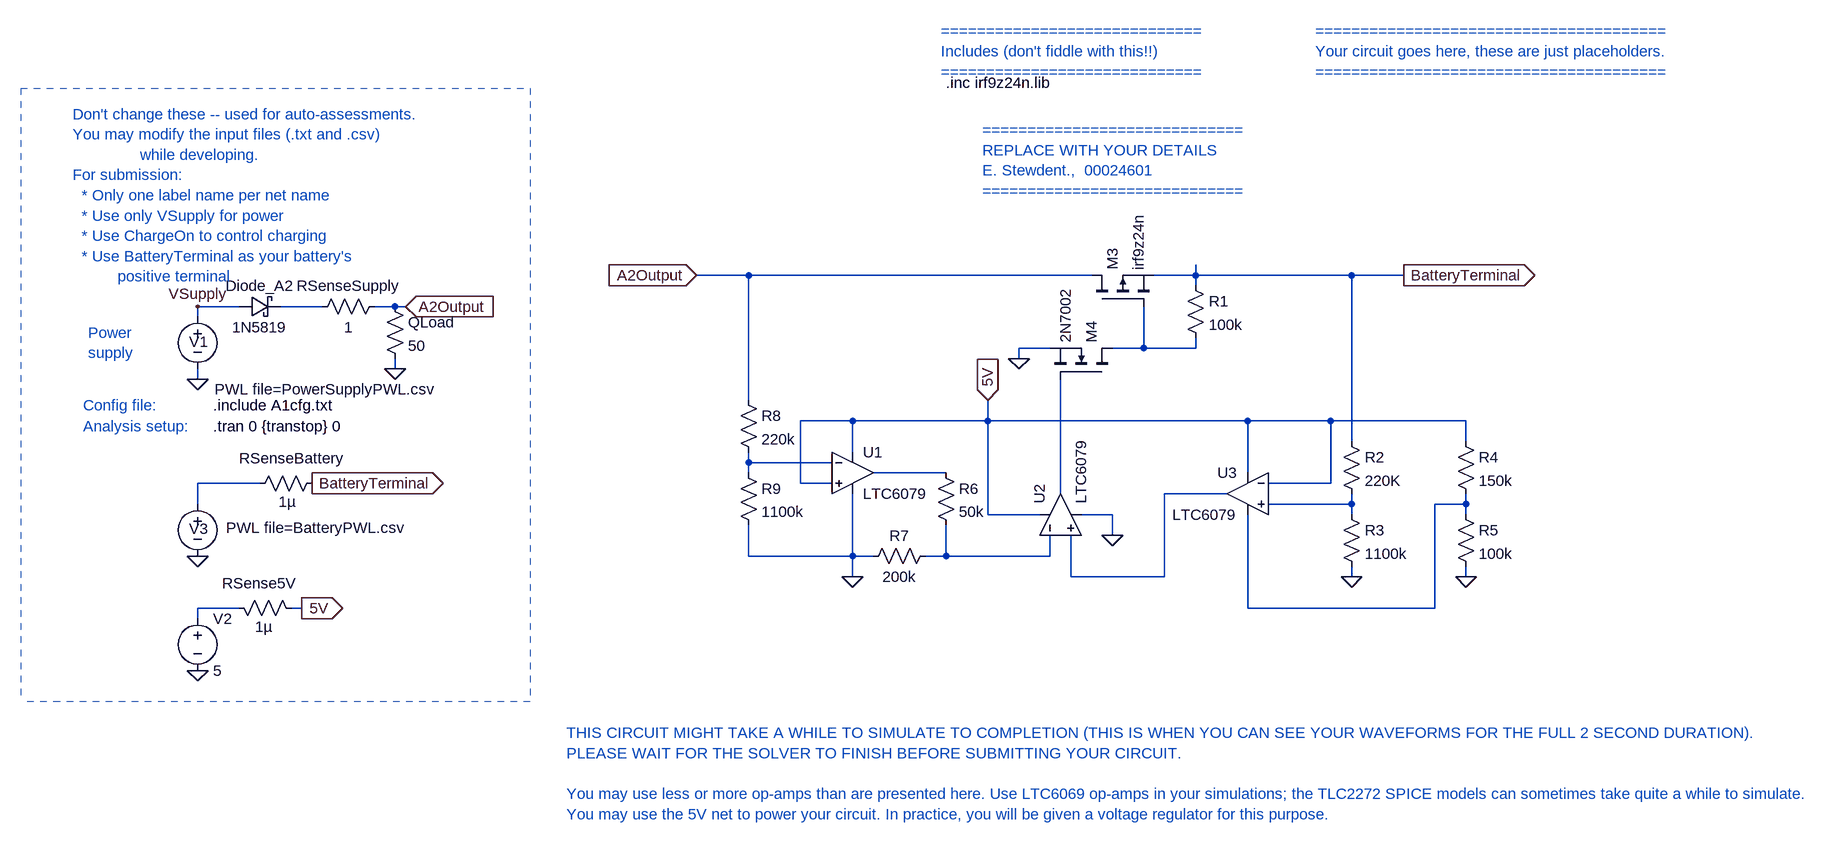
[diagram p0: schematic E344_22897828_A3.asc]
E344_22897828_A3.asc, the LTspice schematic file:
Version 4
SHEET 1 1824 680
WIRE -1248 -1136 -1328 -1136
WIRE -720 -1136 -1248 -1136
WIRE -560 -1136 -560 -1152
WIRE -560 -1136 -624 -1136
WIRE -320 -1136 -560 -1136
WIRE -240 -1136 -320 -1136
WIRE -560 -1120 -560 -1136
WIRE -2032 -1088 -2096 -1088
WIRE -1904 -1088 -1968 -1088
WIRE -1792 -1088 -1824 -1088
WIRE -1776 -1088 -1792 -1088
WIRE -2096 -1072 -2096 -1088
WIRE -784 -1024 -832 -1024
WIRE -640 -1024 -640 -1088
WIRE -640 -1024 -688 -1024
WIRE -560 -1024 -560 -1040
WIRE -560 -1024 -640 -1024
WIRE -832 -1008 -832 -1024
WIRE -1792 -992 -1792 -1008
WIRE -2096 -976 -2096 -992
WIRE -1248 -944 -1248 -1136
WIRE -1088 -912 -1168 -912
WIRE -880 -912 -880 -944
WIRE -880 -912 -1088 -912
WIRE -480 -912 -880 -912
WIRE -352 -912 -480 -912
WIRE -144 -912 -352 -912
WIRE -320 -880 -320 -1136
WIRE -144 -880 -144 -912
WIRE -1088 -864 -1088 -912
WIRE -1248 -848 -1248 -864
WIRE -1120 -848 -1248 -848
WIRE -1248 -832 -1248 -848
WIRE -944 -832 -1056 -832
WIRE -480 -832 -480 -912
WIRE -2000 -816 -2096 -816
WIRE -1168 -816 -1168 -912
WIRE -1120 -816 -1168 -816
WIRE -352 -816 -352 -912
WIRE -352 -816 -448 -816
WIRE -768 -800 -768 -976
WIRE -512 -800 -608 -800
WIRE -2096 -784 -2096 -816
WIRE -320 -784 -320 -800
WIRE -320 -784 -448 -784
WIRE -144 -784 -144 -800
WIRE -144 -784 -192 -784
WIRE -880 -768 -880 -912
WIRE -800 -768 -880 -768
WIRE -688 -768 -736 -768
WIRE -320 -768 -320 -784
WIRE -144 -768 -144 -784
WIRE -688 -736 -688 -768
WIRE -1248 -704 -1248 -752
WIRE -1088 -704 -1088 -800
WIRE -1088 -704 -1248 -704
WIRE -1056 -704 -1088 -704
WIRE -944 -704 -944 -752
WIRE -944 -704 -976 -704
WIRE -784 -704 -784 -736
WIRE -784 -704 -944 -704
WIRE -1088 -672 -1088 -704
WIRE -752 -672 -752 -736
WIRE -608 -672 -608 -800
WIRE -608 -672 -752 -672
WIRE -320 -672 -320 -688
WIRE -144 -672 -144 -688
WIRE -2032 -624 -2096 -624
WIRE -1936 -624 -1952 -624
WIRE -480 -624 -480 -768
WIRE -192 -624 -192 -784
WIRE -192 -624 -480 -624
WIRE -2096 -608 -2096 -624
FLAG -2096 -976 0
FLAG -1776 -1088 A2Output
IOPIN -1776 -1088 In
FLAG -1920 -816 BatteryTerminal
IOPIN -1920 -816 Out
FLAG -2096 -704 0
FLAG -1936 -624 5V
IOPIN -1936 -624 Out
FLAG -2096 -1088 VSupply
FLAG -1792 -992 0
FLAG -2096 -528 0
FLAG -240 -1136 BatteryTerminal
IOPIN -240 -1136 Out
FLAG -1328 -1136 A2Output
IOPIN -1328 -1136 In
FLAG -880 -944 5V
IOPIN -880 -944 In
FLAG -832 -1008 0
FLAG -320 -672 0
FLAG -688 -736 0
FLAG -144 -672 0
FLAG -1088 -672 0
SYMBOL voltage -2096 -1088 R0
WINDOW 123 0 0 Left 0
WINDOW 39 0 0 Left 0
WINDOW 3 26 127 Left 2
WINDOW 0 -13 54 Left 2
SYMATTR Value PWL file=PowerSupplyPWL.csv
SYMATTR InstName V1
SYMBOL res -1904 -832 R90
WINDOW 0 -7 47 VBottom 2
WINDOW 3 29 54 VTop 2
SYMATTR InstName RSenseBattery
SYMATTR Value 1µ
SYMBOL schottky -2032 -1072 R270
WINDOW 0 32 32 VTop 2
WINDOW 3 0 32 VBottom 2
SYMATTR InstName Diode_A2
SYMATTR Value 1N5819
SYMATTR Description Diode
SYMATTR Type diode
SYMBOL voltage -2096 -800 R0
WINDOW 123 0 0 Left 0
WINDOW 39 0 0 Left 0
WINDOW 3 44 52 Left 2
WINDOW 0 -13 54 Left 2
SYMATTR Value PWL file=BatteryPWL.csv
SYMATTR InstName V3
SYMBOL res -1920 -1072 R270
WINDOW 0 32 56 VTop 2
WINDOW 3 0 56 VBottom 2
SYMATTR InstName RSenseSupply
SYMATTR Value 1
SYMBOL res -1808 -1104 R0
SYMATTR InstName QLoad
SYMATTR Value 50
SYMBOL voltage -2096 -624 R0
WINDOW 123 0 0 Left 0
WINDOW 39 0 0 Left 0
SYMATTR InstName V2
SYMATTR Value 5
SYMBOL res -2048 -640 M90
WINDOW 0 -7 47 VBottom 2
WINDOW 3 29 54 VTop 2
SYMATTR InstName RSense5V
SYMATTR Value 1µ
SYMBOL pmos -720 -1088 R270
SYMATTR InstName M3
SYMATTR Value irf9z24n
SYMATTR Prefix X
SYMATTR SpiceModel irf9z24n
SYMBOL nmos -688 -976 M270
SYMATTR InstName M4
SYMATTR Value 2N7002
SYMBOL OpAmps\\LTC6079 -1088 -832 R0
SYMATTR InstName U1
SYMBOL OpAmps\\LTC6079 -768 -768 R270
SYMATTR InstName U2
SYMBOL OpAmps\\LTC6079 -480 -800 M0
SYMATTR InstName U3
SYMBOL res -576 -1136 R0
SYMATTR InstName R1
SYMATTR Value 100k
SYMBOL res -336 -896 R0
SYMATTR InstName R2
SYMATTR Value 220K
SYMBOL res -336 -784 R0
SYMATTR InstName R3
SYMATTR Value 1100k
SYMBOL res -160 -896 R0
SYMATTR InstName R4
SYMATTR Value 150k
SYMBOL res -160 -784 R0
SYMATTR InstName R5
SYMATTR Value 100k
SYMBOL res -960 -848 R0
SYMATTR InstName R6
SYMATTR Value 50k
SYMBOL res -960 -720 R90
WINDOW 0 0 56 VBottom 2
WINDOW 3 32 56 VTop 2
SYMATTR InstName R7
SYMATTR Value 200k
SYMBOL res -1264 -960 R0
SYMATTR InstName R8
SYMATTR Value 220k
SYMBOL res -1264 -848 R0
SYMATTR InstName R9
SYMATTR Value 1100k
TEXT -2072 -904 Left 2 !.tran 0 {transtop} 0
TEXT -2072 -936 Left 2 !.include A1cfg.txt
TEXT -2288 -1384 Left 2 ;Don't change these -- used for auto-assessments.\nYou may modify the input files (.txt and .csv) \n               while developing.\nFor submission: \n  * Only one label name per net name\n  * Use only VSupply for power\n  * Use ChargeOn to control charging\n  * Use BatteryTerminal as your battery's \n          positive terminal
TEXT -2272 -936 Left 2 ;Config file:
TEXT -2272 -904 Left 2 ;Analysis setup:
TEXT -2264 -1048 Left 2 ;Power\nsupply
TEXT -888 -1360 Left 2 ;=============================\nREPLACE WITH YOUR DETAILS\nE. Stewdent.,  00024601\n=============================
TEXT -944 -1432 Left 2 !.inc irf9z24n.lib
TEXT -952 -1512 Left 2 ;=============================\nIncludes (don't fiddle with this!!)\n=============================
TEXT -376 -1512 Left 2 ;=======================================\nYour circuit goes here, these are just placeholders.\n=======================================
TEXT -1528 -432 Left 2 ;THIS CIRCUIT MIGHT TAKE A WHILE TO SIMULATE TO COMPLETION (THIS IS WHEN YOU CAN SEE YOUR WAVEFORMS FOR THE FULL 2 SECOND DURATION).\nPLEASE WAIT FOR THE SOLVER TO FINISH BEFORE SUBMITTING YOUR CIRCUIT.\n \nYou may use less or more op-amps than are presented here. Use LTC6069 op-amps in your simulations; the TLC2272 SPICE models can sometimes take quite a while to simulate.\nYou may use the 5V net to power your circuit. In practice, you will be given a voltage regulator for this purpose.
LINE Normal -1584 -1424 -1584 -480 2
LINE Normal -2368 -1424 -1584 -1424 2
LINE Normal -1584 -480 -2368 -480 2
LINE Normal -1584 -496 -1584 -496 2
LINE Normal -2368 -1424 -2368 -480 2

The netlist it stands for:
* E344_22897828_A3.asc
V1 VSupply 0 PWL file=PowerSupplyPWL.csv
RSenseBattery BatteryTerminal N005 1µ
Diode_A2 VSupply N001 1N5819
V3 N005 0 PWL file=BatteryPWL.csv
RSenseSupply N001 A2Output 1
R§QLoad A2Output 0 50
V2 N011 0 5
RSense5V N011 5V 1µ
XM3 A2Output N002 BatteryTerminal irf9z24n irf9z24n  ; pins D G S
M4 N002 N006 0 0 2N7002
XU1 5V N003 5V 0 N004 LTC6078  ; LTC6079, pins In+ In- V+ V- OUT
XU2 N007 N010 5V 0 N006 LTC6078  ; LTC6079, pins In+ In- V+ V- OUT
XU3 N008 5V 5V N009 N007 LTC6078  ; LTC6079, pins In+ In- V+ V- OUT
R1 BatteryTerminal N002 100k
R2 BatteryTerminal N008 220K
R3 N008 0 1100k
R4 5V N009 150k
R5 N009 0 100k
R6 N004 N010 50k
R7 N010 0 200k
R8 A2Output N003 220k
R9 N003 0 1100k
.model D D
.lib standard.dio
.model NMOS NMOS
.model PMOS PMOS
.lib standard.mos
.tran 0 {transtop} 0
.include A1cfg.txt
* Don't change these -- used for auto-assessments.
* You may modify the input files (.txt and .csv)
*                while developing.
* For submission:
*   * Only one label name per net name
*   * Use only VSupply for power
*   * Use ChargeOn to control charging
*   * Use BatteryTerminal as your battery's
*           positive terminal
* Config file:
* Analysis setup:
* Power
* supply
* =============================
* REPLACE WITH YOUR DETAILS
* E. Stewdent.,  00024601
* =============================
.inc irf9z24n.lib
* =============================
* Includes (don't fiddle with this!!)
* =============================
* =======================================
* Your circuit goes here, these are just placeholders.
* =======================================
* THIS CIRCUIT MIGHT TAKE A WHILE TO SIMULATE TO COMPLETION (THIS IS WHEN YOU CAN SEE YOUR WAVEFORMS FOR THE FULL 2 SECOND DURATION).
* PLEASE WAIT FOR THE SOLVER TO FINISH BEFORE SUBMITTING YOUR CIRCUIT.
* You may use less or more op-amps than are presented here. Use LTC6069 op-amps in your simulations; the TLC2272 SPICE models can sometimes take quite a while to simulate.
* You may use the 5V net to power your circuit. In practice, you will be given a voltage regulator for this purpose.
.lib LTC5.lib
.backanno
.end

* Results of the author's LTspice run, read from the files saved beside the schematic
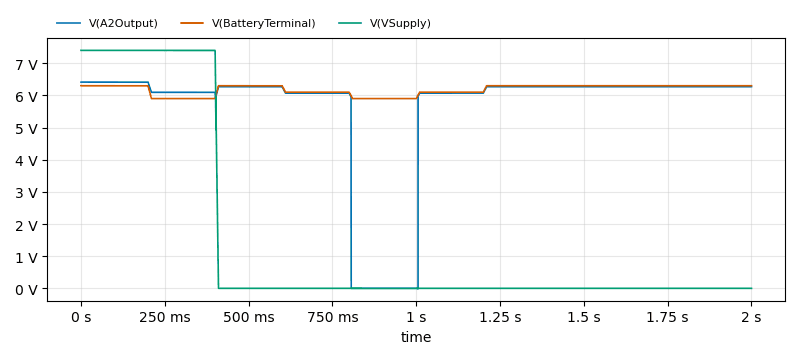
[diagram p1: Transient Analysis of E344_22897828_A3.asc, plotted from the saved traces]
* Transient Analysis, 1 run:
*   V(A2Output): min -14.86 mV, max 6.412 V, average 5.599 V, rms 5.903 V, last 6.27 V
*   V(BatteryTerminal): min 5.9 V, max 6.3 V, average 6.18 V, rms 6.182 V, last 6.3 V
*   V(VSupply): min 0 V, max 7.4 V, average 1.499 V, rms 3.325 V, last 0 V